# Altium schematic sheet debug.SchDoc
size A4
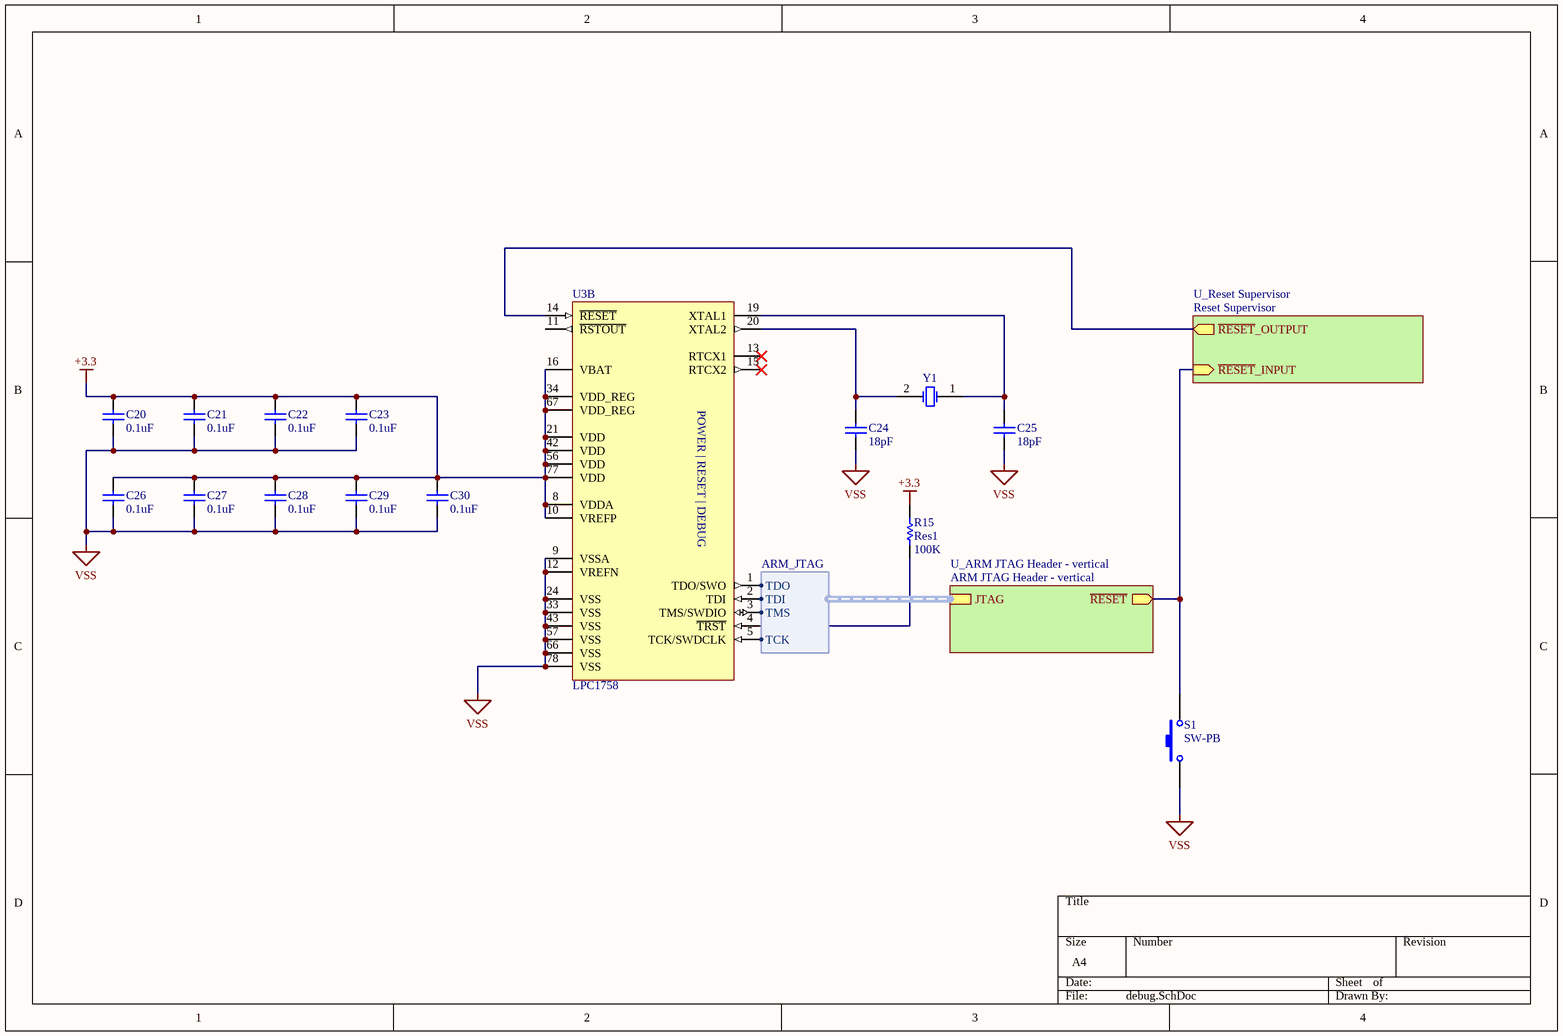
[diagram p0: debug.SchDoc]

## Parts
C20  value 0.1uF  [C0805]  (hidden comment: Cap)
C21  value 0.1uF  [C0805]  (hidden comment: Cap)
C22  value 0.1uF  [C0805]  (hidden comment: Cap)
C23  value 0.1uF  [C0805]  (hidden comment: Cap)
C24  value 18pF  [C0805]  (hidden comment: Cap)
C25  value 18pF  [C0805]  (hidden comment: Cap)
C26  value 0.1uF  [C0805]  (hidden comment: Cap)
C27  value 0.1uF  [C0805]  (hidden comment: Cap)
C28  value 0.1uF  [C0805]  (hidden comment: Cap)
C29  value 0.1uF  [C0805]  (hidden comment: Cap)
C30  value 0.1uF  [C0805]  (hidden comment: Cap)
R15  Res1  value 100K  [R0603]
S1  SW-PB  [DTSM-32S-B]
U3  LPC1758  [LPC1758FBD80]  (part B of 3)
Y1  XTAL  [C3E-24.000-12-3030-X]  (value not drawn)

## Sub-sheets
U_ARM JTAG Header - vertical = ARM JTAG Header - vertical: JTAG (harness ARM_JTAG), ~{RESET} (out)
U_Reset Supervisor = Reset Supervisor: ~{RESET}_OUTPUT (out), ~{RESET}_INPUT (in)

## Harnesses
ARM_JTAG: TCK, TDI, TDO, TMS

## Nets
+3.3: C20.1 C21.1 C22.1 C23.1 C26.1 C27.1 C28.1 C29.1 C30.1 R15.2 U3.8(VDDA) U3.10(VREFP) U3.16(VBAT) U3.21(VDD) U3.34(VDD_REG) U3.42(VDD) U3.56(VDD) U3.67(VDD_REG) U3.77(VDD)
VSS: C20.2 C21.2 C22.2 C23.2 C24.2 C25.2 C26.2 C27.2 C28.2 C29.2 C30.2 S1.1 U3.9(VSSA) U3.12(VREFN) U3.24(VSS) U3.33(VSS) U3.43(VSS) U3.57(VSS) U3.66(VSS) U3.78(VSS)
NetC24_1: C24.1 U3.20(XTAL2) Y1.2(OSC2)
NetC25_1: C25.1 U3.19(XTAL1) Y1.1(OSC1)
NetR15_1: R15.1 U3.4(~{TRST})
NetS1_2: S1.2 ; sheet U_Reset Supervisor/~{RESET}_INPUT, sheet U_ARM JTAG Header - vertical/~{RESET}
NetU3_1: U3.1(TDO/SWO) ; sheet U_ARM JTAG Header - vertical/JTAG.TDO
NetU3_2: U3.2(TDI) ; sheet U_ARM JTAG Header - vertical/JTAG.TDI
NetU3_3: U3.3(TMS/SWDIO) ; sheet U_ARM JTAG Header - vertical/JTAG.TMS
NetU3_5: U3.5(TCK/SWDCLK) ; sheet U_ARM JTAG Header - vertical/JTAG.TCK
NetU3_14: U3.14(~{RESET}) ; sheet U_Reset Supervisor/~{RESET}_OUTPUT

Not connected (* = marked no-connect by the designer): U3 11(~{RSTOUT}) 13(RTCX1)* 15(RTCX2)*

## Notes on the sheet
- (in symbol LPC1758, part B) POWER | RESET | DEBUG

## Library data of the parts
C20-C30 = Cap: Capacitor; Published: 8-Jun-2000; LatestRevisionDate: 17-Jul-2002; LatestRevisionNote: Re-released for DXP Platform.; PackageReference: RAD-0.3; Publisher: Altium Limited
  C20-C23 C26-C30: farnell: 1414664
  C24 C25: farnell: 1414673
R15 = Res1: Resistor; Published: 8-Jun-2000; LatestRevisionDate: 17-Jul-2002; LatestRevisionNote: Re-released for DXP Platform.; PackageReference: AXIAL-0.3; Publisher: Altium Limited; farnell: 9330402
S1 = SW-PB: Switch; Published: 24-Mar-1999; LatestRevisionDate: 17-Jul-2002; LatestRevisionNote: Re-released for DXP Platform.; PackageReference: SPST-2; Publisher: Altium Limited; farnell: 9471898
U3 = LPC1758: NXP - LPC1758FBD80 - MCU, 32BIT, ARM CORTEX M3, 80LQFP; farnell: 1718545
Y1 = XTAL: Crystal Oscillator; Published: 8-Jun-2000; LatestRevisionDate: 17-Jul-2002; LatestRevisionNote: Re-released for DXP Platform.; PackageReference: R38; Publisher: Altium Limited; farnell: 1538861